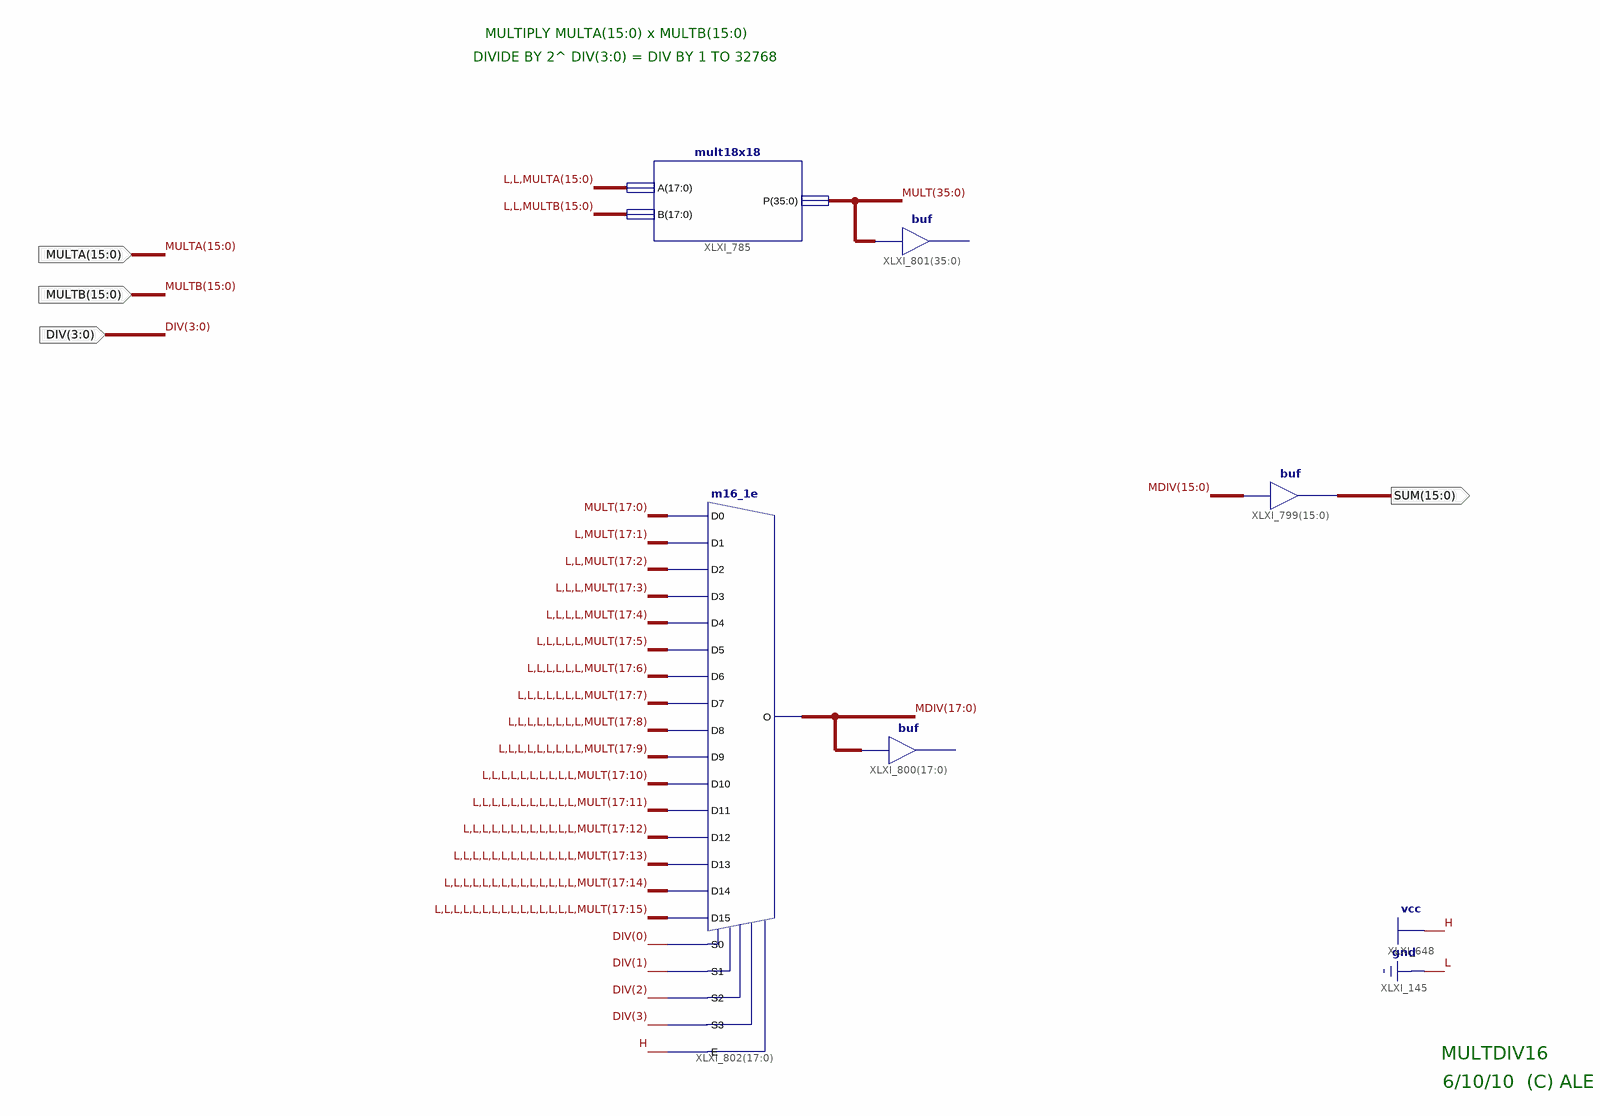
[diagram p0: schematic sheet 1]
// Xilinx ISE schematic DB_MultDiv16.sch (aspartan3e) as structural Verilog: 5 symbols, 4 ports
module DB_MultDiv16 (
  input  [15:0] MULTA,
  input  [15:0] MULTB,
  input  [3:0] DIV,
  output [15:0] SUM
);

  wire [17:0] MDIV;
  wire [35:0] MULT;

  mult18x18 XLXI_785 (.A({2'b00, MULTA}), .B({2'b00, MULTB}), .P(MULT));
  assign SUM = MDIV[15:0];  // buf XLXI_799[15..0], 16 bits wide
  // buf XLXI_801[35..0] has open pins: I=MULT, O=open
  m16_1e XLXI_802[17:0] (
    .D0(MULT[17:0]), .D1({1'b0, MULT[17:1]}), .D10({{10{1'b0}}, MULT[17:10]}),
    .D11({{11{1'b0}}, MULT[17:11]}), .D12({{12{1'b0}}, MULT[17:12]}), .D13({{13{1'b0}}, MULT[17:13]}),
    .D14({{14{1'b0}}, MULT[17:14]}), .D15({{15{1'b0}}, MULT[17:15]}), .D2({2'b00, MULT[17:2]}),
    .D3({3'b000, MULT[17:3]}), .D4({4'b0000, MULT[17:4]}), .D5({{5{1'b0}}, MULT[17:5]}),
    .D6({{6{1'b0}}, MULT[17:6]}), .D7({{7{1'b0}}, MULT[17:7]}), .D8({{8{1'b0}}, MULT[17:8]}),
    .D9({{9{1'b0}}, MULT[17:9]}), .E(1'b1), .S0(DIV[0]), .S1(DIV[1]), .S2(DIV[2]), .S3(DIV[3]), .O(MDIV));
  // buf XLXI_800[17..0] has open pins: I=MDIV, O=open

  // Notes on the sheet:
  //   MULTIPLY MULTA(15:0) x MULTB(15:0)
  //   DIVIDE BY 2^ DIV(3:0) = DIV BY 1 TO 32768
  //   MULTDIV16
  //   6/10/10  (C) ALE
endmodule
